# EAGLE design SOT-23-8-SOIC-8-Adapter (EAGLE 7.3.0)
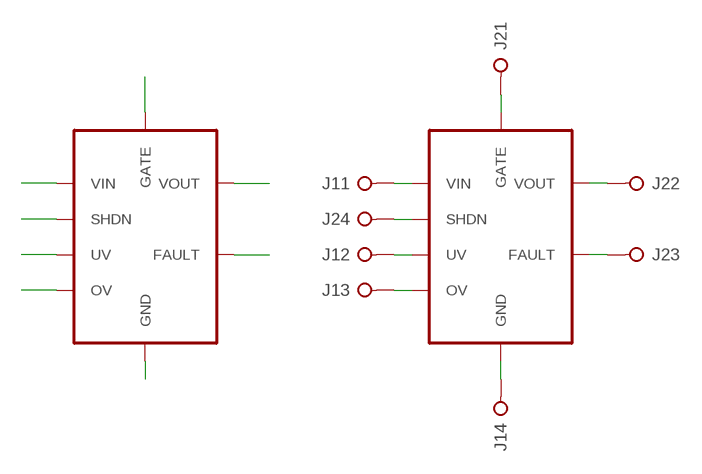
[diagram p0: schematic, sheet 1]

## Parts
J1  PINHD-1X4  [1X04]
J2  PINHD-1X4  [1X04]
Q1  LTC4365  [SOT-23-8]
U$1  DUMMY1  [SOIC-08]

## Nets
1-1: J1.1 Q1.1(VIN) U$1.1(VIN)
1-2: J1.2 Q1.2(UV) U$1.2(UV)
1-3: J1.3 Q1.3(OV) U$1.3(OV)
1-4: J1.4 Q1.4(GND) U$1.4(GND)
2-1: J2.1 Q1.8(GATE) U$1.8(GATE)
2-2: J2.2 Q1.7(VOUT) U$1.7(VOUT)
2-3: J2.3 Q1.6(FAULT) U$1.6(FAULT)
2-4: J2.4 Q1.5(SHDN) U$1.5(SHDN)

## Library data of the parts
J1 J2 = SaintGimp:PINHD-1X4
Q1 = SaintGimp:LTC4365: LTC4365 Overvoltage, Undervoltage and Reverse Supply Protection Controller
U$1 = SaintGimp:DUMMY1: Not a real device, just used to build SMD adapter board

## Board
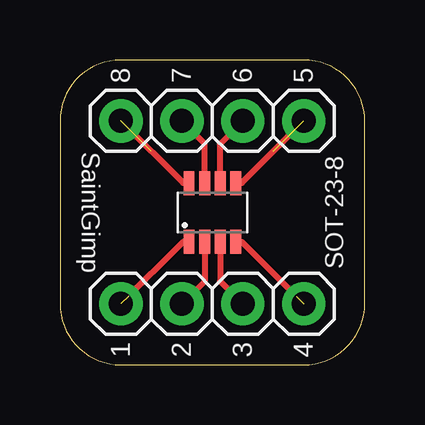
[diagram p1: board, top side]
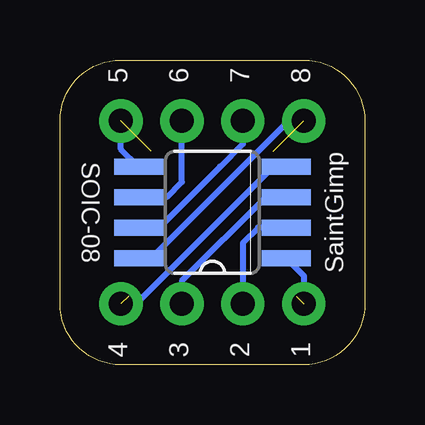
[diagram p2: board, bottom side, seen from below]

Size 12.7 x 12.7 mm. Coordinates in mm from the lower left corner, seen from the top.
Outline: 12.7,2.54 12.7,10.16 arc90 10.16,12.7 2.54,12.7 arc90 0,10.16 0,2.54 arc90 2.54,0 10.16,0 arc90 12.7,2.54
Copper layers (1*16): Top 0.0356mm / dielectric 1.5011mm / Bottom 0.0356mm
Design rules "Saintgimp-OSHPark": minimum track width 10mil, minimum drill 13mil, track to track 6mil, track to pad 6mil, pad to pad 6mil, via to via 6mil, smd to smd 6mil, copper to edge 15mil, drill to drill 6mil, minimum pad ring 12mil, minimum via ring 7mil, stop-mask expansion 2mil, vias tented up to drill 20mil, thermal gap 10mil

### Footprints (pad centres in the part's own frame; a part is rotated, then mirrored left to right if it is on the bottom)
1X04 = drill 1: 1 -3.81,0; 2 -1.27,0; 3 1.27,0; 4 3.81,0
SOT-23-8 = smd 0.45 x 1: 1 -0.975,-1.225; 2 -0.325,-1.225; 3 0.325,-1.225; 4 0.975,-1.225; 5 0.975,1.225; 6 0.325,1.225; 7 -0.325,1.225; 8 -0.975,1.225
SOIC-08 = smd 0.66 x 2.032: 1 -1.905,-3.073; 2 -0.635,-3.073; 3 0.635,-3.073; 4 1.905,-3.073; 5 1.905,3.073; 6 0.635,3.073; 7 -0.635,3.073; 8 -1.905,3.073

### Placement (x,y rotation side)
J1  6.35,2.54 0 top
J2  6.35,10.16 0 top
Q1  6.35,6.35 0 top
U$1  6.35,6.35 90 bottom

### Tracks (layer width: path | path; a pad name or v marks a point on that pad's centre or on a via)
1-1  (1 unrouted)
  Top 0.254: Q1.1 5.12,5.12 J1.1
  Bottom 0.254: U$1.1 2.54,3.71 J1.1
1-2
  Top 0.254: Q1.2 6.03,3.48 J1.2
  Bottom 0.254: U$1.2 4.45,5.71 5.08,5.08 J1.2
1-3
  Top 0.254: Q1.3 6.67,3.48 J1.3
  Bottom 0.254: U$1.3 4.13,6.99 7.62,3.49 J1.3
1-4  (1 unrouted)
  Top 0.254: Q1.4 7.58,5.12 J1.4
  Bottom 0.254: U$1.4 3.81,8.26 9.53,2.54 J1.4
2-1  (1 unrouted)
  Top 0.254: Q1.8 5.12,7.58 J2.1
  Bottom 0.254: U$1.8 8.89,4.45 3.17,10.16 J2.1
2-2
  Top 0.254: Q1.7 6.03,9.21 J2.2
  Bottom 0.254: U$1.7 8.56,5.71 6.03,8.26 5.08,9.21 J2.2
2-3
  Top 0.254: Q1.6 6.67,9.21 J2.3
  Bottom 0.254: U$1.6 8.26,6.99 7.62,7.62 J2.3
2-4  (1 unrouted)
  Top 0.254: Q1.5 7.58,7.58 J2.4
  Bottom 0.254: U$1.5 10.16,8.99 J2.4

### Text on the board
_tsilk: 8 | 7 | 6 | 5 | SaintGimp | SOT-23-8 | 1 | 2 | 3 | 4
_bsilk: 8 | 7 | 6 | 5 | SaintGimp | SOIC-08 | 1 | 2 | 3 | 4